# EAGLE design AIN_J5_J7_VoltSlide (EAGLE 7.5.0)
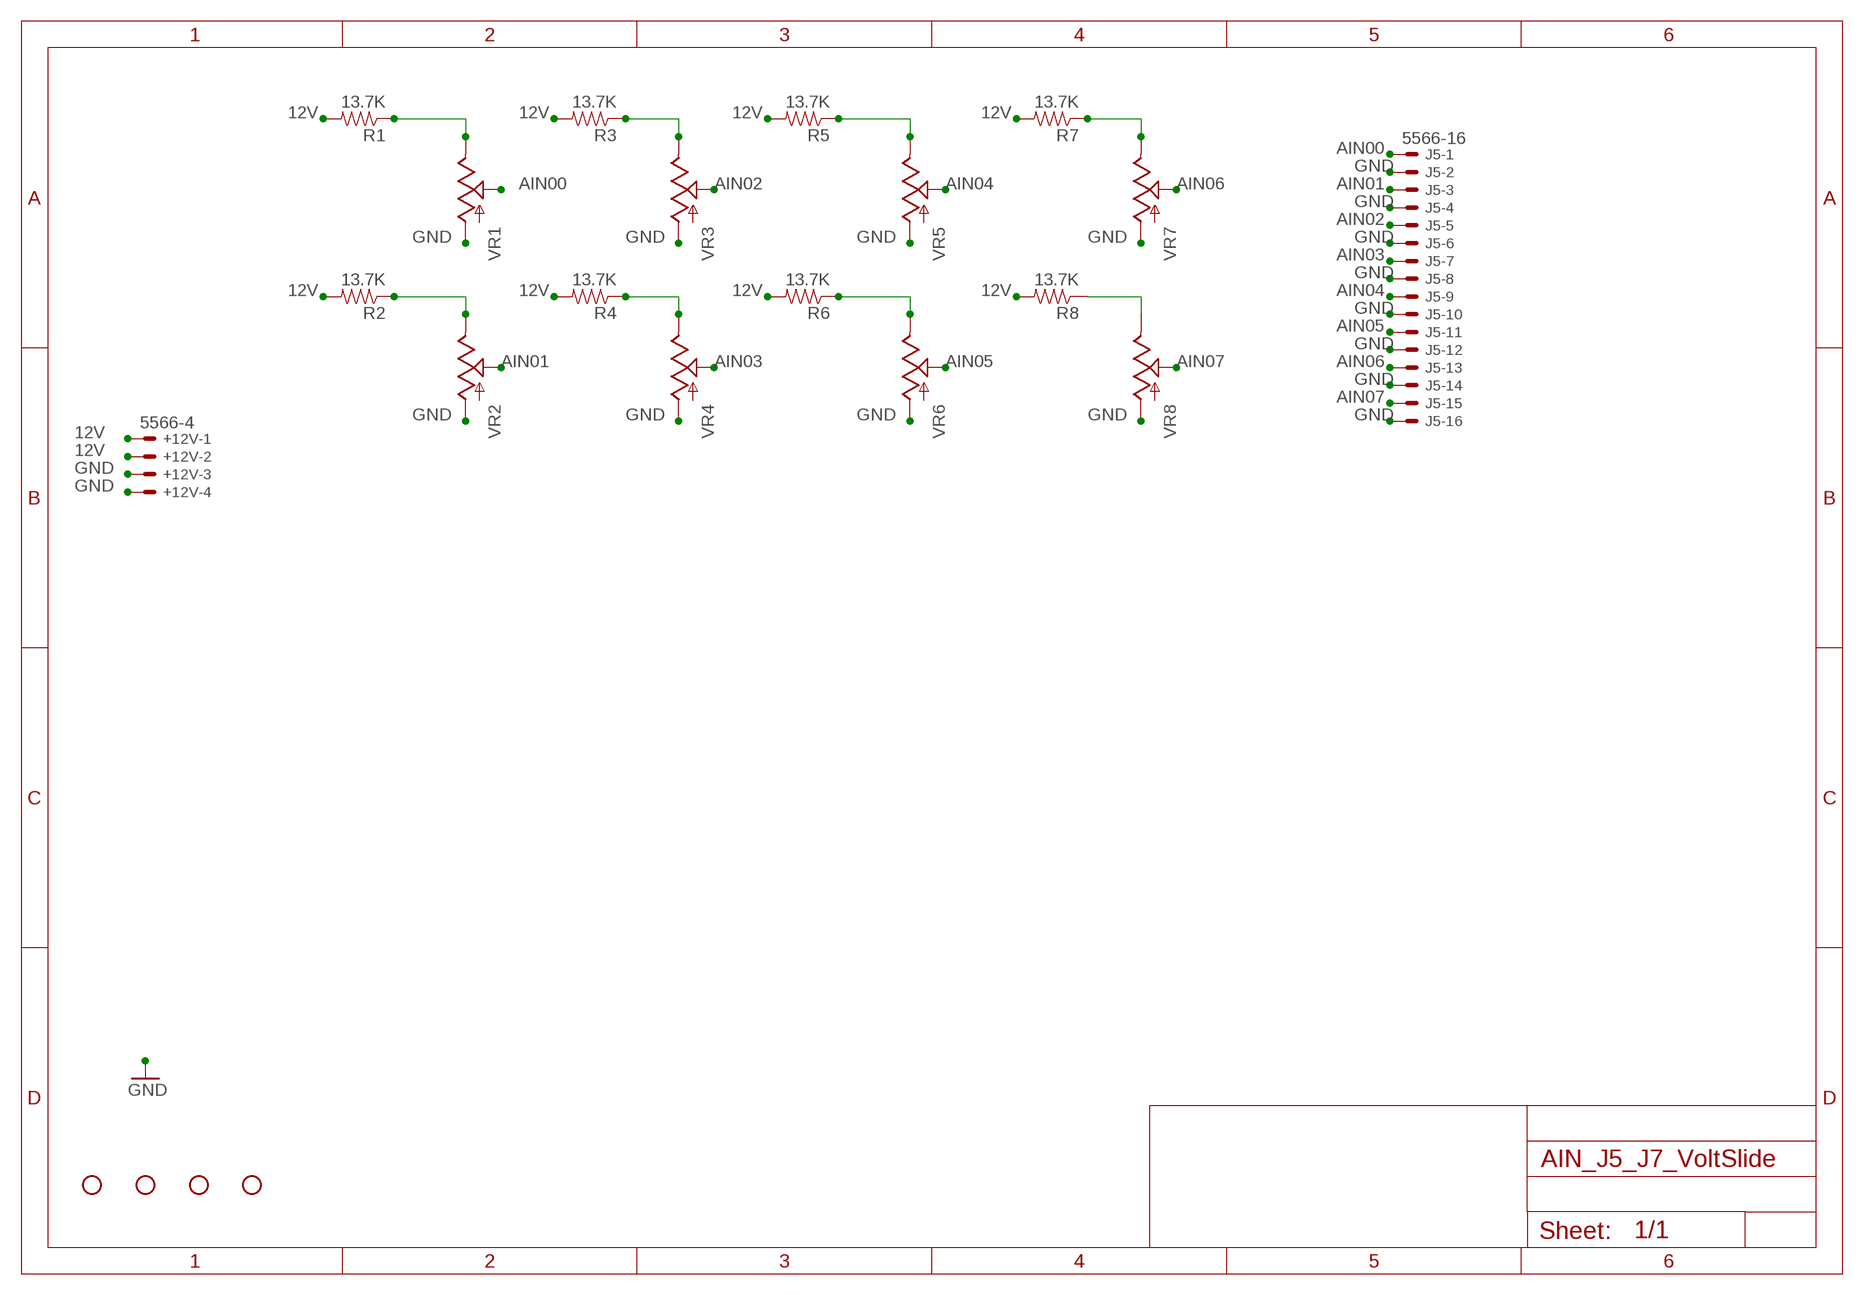
[diagram p0: schematic, sheet 1]

## Parts
+12V  5566-4  [5566-4]
H1  STAND-OFF  [STAND-OFF]
H2  STAND-OFF  [STAND-OFF]
H3  STAND-OFF  [STAND-OFF]
H4  STAND-OFF  [STAND-OFF]
J5  5566-16  [5566-16]
R1  13.7K  13.7KOHM1/10W1%(0603)  [0603-RES]
R2  13.7K  13.7KOHM1/10W1%(0603)  [0603-RES]
R3  13.7K  13.7KOHM1/10W1%(0603)  [0603-RES]
R4  13.7K  13.7KOHM1/10W1%(0603)  [0603-RES]
R5  13.7K  13.7KOHM1/10W1%(0603)  [0603-RES]
R6  13.7K  13.7KOHM1/10W1%(0603)  [0603-RES]
R7  13.7K  13.7KOHM1/10W1%(0603)  [0603-RES]
R8  13.7K  13.7KOHM1/10W1%(0603)  [0603-RES]
VR1  SLIDER30MM  [SLIDER-MEDIUM]
VR2  SLIDER30MM  [SLIDER-MEDIUM]
VR3  SLIDER30MM  [SLIDER-MEDIUM]
VR4  SLIDER30MM  [SLIDER-MEDIUM]
VR5  SLIDER30MM  [SLIDER-MEDIUM]
VR6  SLIDER30MM  [SLIDER-MEDIUM]
VR7  SLIDER30MM  [SLIDER-MEDIUM]
VR8  SLIDER30MM  [SLIDER-MEDIUM]

## Nets
12V: +12V.1 +12V.2 R1.2 R2.2 R3.2 R4.2 R5.2 R6.2 R7.2 R8.2
AIN00: J5.1 VR1.WIPER(S)
AIN01: J5.3 VR2.WIPER(S)
AIN02: J5.5 VR3.WIPER(S)
AIN03: J5.7 VR4.WIPER(S)
AIN04: J5.9 VR5.WIPER(S)
AIN05: J5.11 VR6.WIPER(S)
AIN06: J5.13 VR7.WIPER(S)
AIN07: J5.15 VR8.WIPER(S)
GND: +12V.3 +12V.4 J5.2 J5.4 J5.6 J5.8 J5.10 J5.12 J5.14 J5.16 VR1.BOTTOM(A) VR2.BOTTOM(A) VR3.BOTTOM(A) VR4.BOTTOM(A) VR5.BOTTOM(A) VR6.BOTTOM(A) VR7.BOTTOM(A) VR8.BOTTOM(A)
N$1: R8.1 VR8.TOP(E)
N$37: R1.1 VR1.TOP(E)
N$38: R3.1 VR3.TOP(E)
N$39: R5.1 VR5.TOP(E)
N$44: R6.1 VR6.TOP(E)
N$45: R2.1 VR2.TOP(E)
N$49: R4.1 VR4.TOP(E)
N$89: R7.1 VR7.TOP(E)

## Library data of the parts
+12V = con-molex:5566-4: Mini FIT connector 4 pol Source: http://www.molex.com
H1-H4 = SparkFun-Electromechanical:STAND-OFF: #4 Stand Off This is the mechanical footprint for a #4 phillips button head screw. Use the keepout ring to avoid running the screw head into surrounding components. SKU : PRT-00447
J5 = con-molex:5566-16: Mini FIT connector 16 pol Source: http://www.molex.com
R1-R8 = SparkFun-Resistors:13.7KOHM1/10W1%(0603): RES-08603; PROD_ID: RES-08603
VR1-VR8 = SparkFun-Electromechanical:SLIDER: Slide-type potentiometers. Small and meduim footprints untested.; PROD_ID: COM-11621

## Board
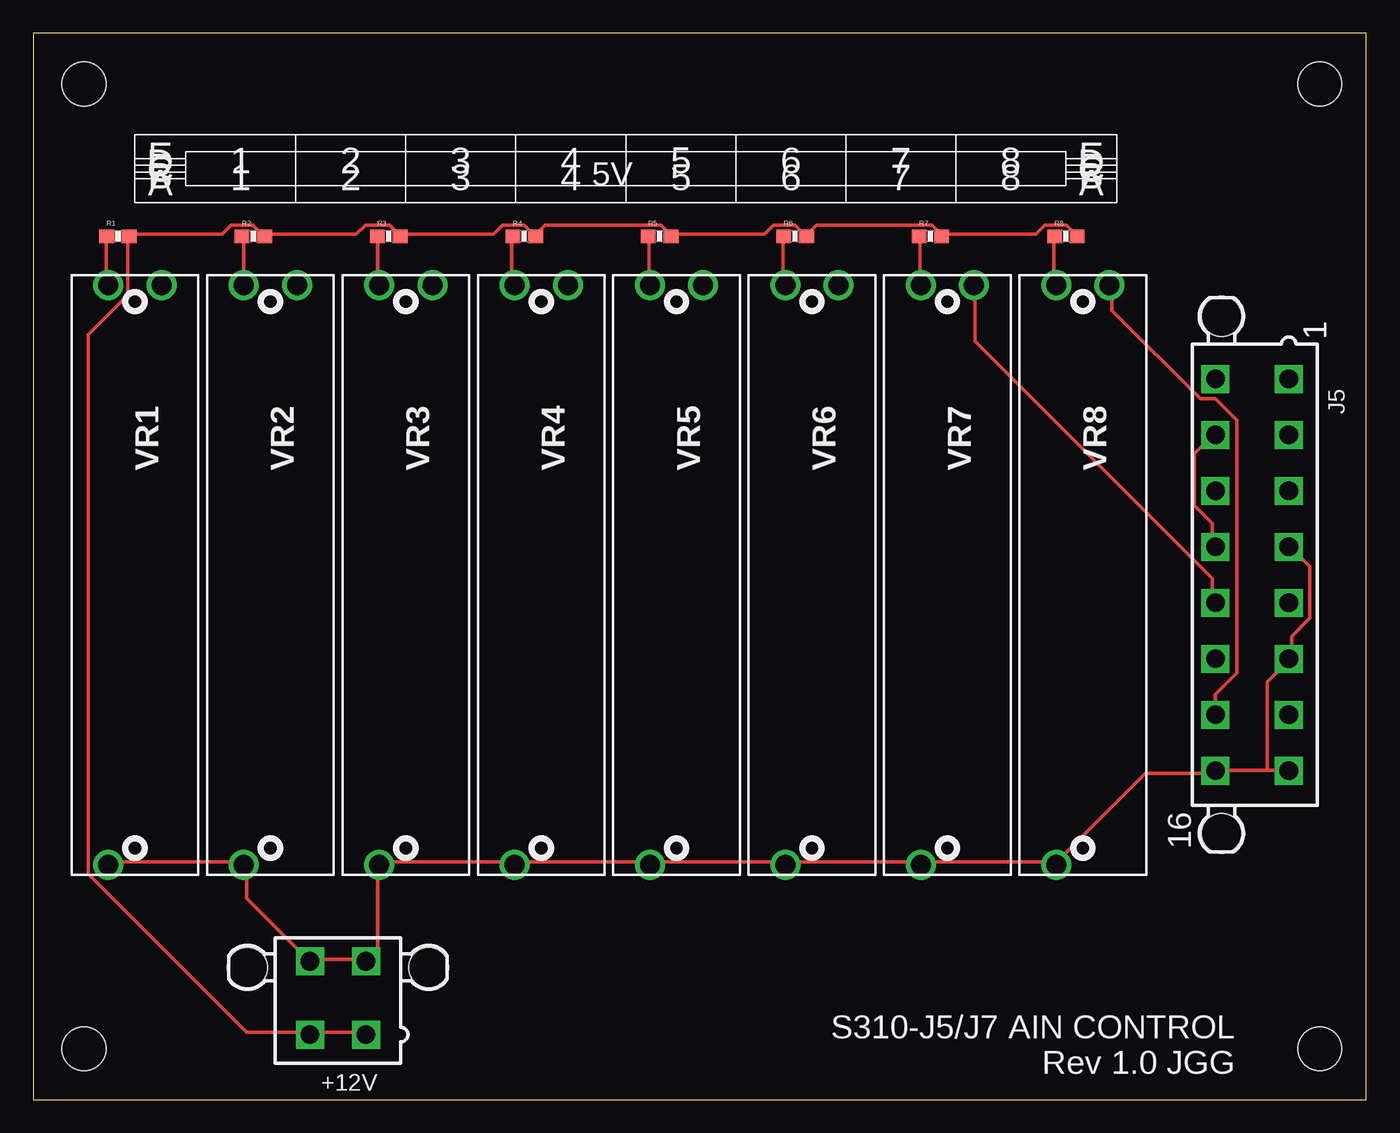
[diagram p1: board, top side]
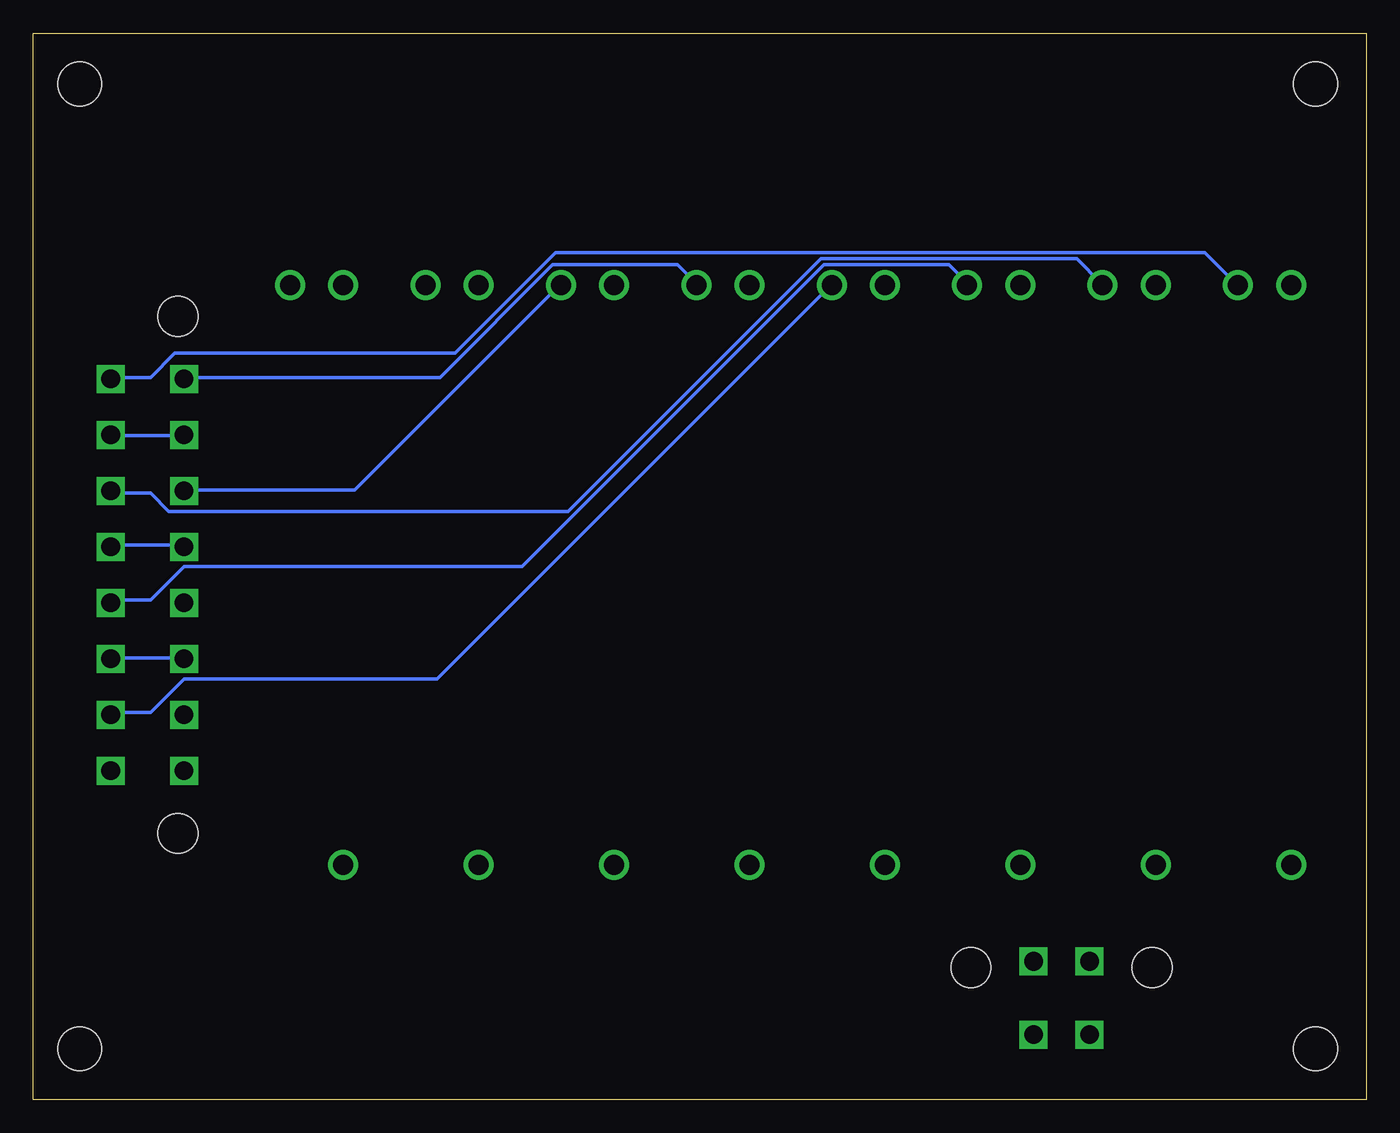
[diagram p2: board, bottom side, seen from below]

Size 100 x 80 mm. Coordinates in mm from the lower left corner, seen from the top.
Outline: 0,0 100,0 100,80 0,80 0,0
Copper layers (1*16): Top 0.035mm / dielectric 1.5mm / Bottom 0.035mm
Design rules "default": minimum track width 10mil, minimum drill 24mil, track to track 8mil, track to pad 8mil, pad to pad 8mil, via to via 8mil, smd to smd 8mil, copper to edge 40mil, drill to drill 8mil, minimum pad ring 10mil, minimum via ring 8mil, stop-mask expansion 4mil, vias tented up to drill 0mil, thermal gap 10mil

### Footprints (pad centres in the part's own frame; a part is rotated, then mirrored left to right if it is on the bottom)
5566-4 = drill 1.4 square: 1 2.1,-2.75; 2 -2.1,-2.75; 3 2.1,2.75; 4 -2.1,2.75 | hole 3: 6.8,2.29; -6.8,2.29
STAND-OFF = hole 3.302: 0,0
5566-16 = drill 1.4 square: 1 14.7,-2.75; 2 10.5,-2.75; 3 6.3,-2.75; 4 2.1,-2.75; 5 -2.1,-2.75; 6 -6.3,-2.75; 7 -10.5,-2.75; 8 -14.7,-2.75; 9 14.7,2.75; 10 10.5,2.75; 11 6.3,2.75; 12 2.1,2.75; 13 -2.1,2.75; 14 -6.3,2.75; 15 -10.5,2.75; 16 -14.7,2.75 | hole 3: 19.4,2.29; -19.4,2.29
0603-RES = smd 1.1 x 1: 1 -0.85,0; 2 0.85,0
SLIDER-MEDIUM = drill 1.5: BOTTOM 21.75,-2; TOP -21.75,-2; WIPER -21.75,2

### Placement (x,y rotation side)
+12V  22.86,7.62 0 top
H1  96.52,3.81 0 top
H2  3.81,3.81 0 top
H3  96.52,76.2 0 top
H4  3.81,76.2 0 top
J5  91.44,39.37 90 top
R1  6.35,64.77 0 top
R2  16.51,64.77 0 top
R3  26.67,64.77 0 top
R4  36.83,64.77 0 top
R5  46.99,64.77 0 top
R6  57.15,64.77 0 top
R7  67.31,64.77 0 top
R8  77.47,64.77 0 top
VR1  7.62,39.37 270 top
VR2  17.78,39.37 270 top
VR3  27.94,39.37 270 top
VR4  38.1,39.37 270 top
VR5  48.26,39.37 270 top
VR6  58.42,39.37 270 top
VR7  68.58,39.37 270 top
VR8  78.74,39.37 270 top

### Tracks (layer width: path | path; a pad name or v marks a point on that pad's centre or on a via)
12V
  Top 0.254: +12V.1 24.92,5.03 20.8,5.03 +12V.2 20.57,5.03 16,5.03 4.12,16.92 4.12,57.38 7.09,60.35 7.09,64.69 R1.2 7.32,64.92 14.17,64.92 14.86,65.61 16.46,65.61 17.14,64.92 R2.2 17.37,64.92 24.23,64.92 24.92,65.61 26.75,65.61 27.43,64.92 R3.2 27.66,64.92 34.52,64.92 35.2,65.61 36.8,65.61 37.49,64.92 R4.2 37.72,64.92 38.41,65.61 47.09,65.61 47.78,64.92 R5.2 48.01,64.92 54.86,64.92 55.55,65.61 57.15,65.61 57.84,64.92 R6.2 58.06,64.92 58.75,65.61 67.44,65.61 68.12,64.92 R7.2 68.35,64.92 75.21,64.92 75.89,65.61 77.5,65.61 78.18,64.92 R8.2
AIN00
  Bottom 0.254: J5.1 94.18,54.18 91.21,54.18 89.38,56.01 68.35,56.01 60.81,63.55 12.12,63.55 9.83,61.27 VR1.WIPER
AIN01
  Bottom 0.254: J5.3 94.18,45.49 91.21,45.49 89.84,44.12 59.89,44.12 40.92,63.09 21.72,63.09 19.89,61.27 VR2.WIPER
AIN02
  Bottom 0.254: J5.5 94.18,37.49 91.21,37.49 88.7,40.01 63.32,40.01 40.69,62.64 31.32,62.64 29.95,61.27 VR3.WIPER
AIN03
  Bottom 0.254: J5.7 94.18,29.03 91.21,29.03 88.7,31.55 69.72,31.55 40.23,61.04 VR4.WIPER
AIN04
  Bottom 0.254: J5.9 88.47,54.18 69.49,54.18 61.04,62.64 51.66,62.64 50.29,61.27 VR5.WIPER
AIN05
  Bottom 0.254: J5.11 88.47,45.72 75.89,45.72 60.58,61.04 VR6.WIPER
AIN06
  Top 0.254: J5.13 88.47,37.49 88.47,39.09 70.64,56.92 70.64,61.04 VR7.WIPER
AIN07
  Top 0.254: J5.15 88.7,29.03 88.7,30.4 90.3,32 90.3,50.98 88.7,52.58 87.55,52.58 80.92,59.21 80.92,61.04 VR8.WIPER
GND
  Top 0.254: 92.58,24.69 94.18,24.69 J5.8 | 92.58,24.69 88.7,24.69 J5.16 88.47,24.46 83.44,24.46 76.81,17.83 VR8.BOTTOM 76.58,17.83 66.75,17.83 VR7.BOTTOM 66.52,17.83 56.46,17.83 VR6.BOTTOM 56.24,17.83 46.41,17.83 VR5.BOTTOM 46.18,17.83 36.12,17.83 VR4.BOTTOM 35.89,17.83 26.06,17.83 VR3.BOTTOM 25.83,17.6 25.83,11.2 25.15,10.52 +12V.3 24.92,10.52 20.8,10.52 +12V.4 20.57,10.52 16,15.09 16,17.6 VR2.BOTTOM 15.77,17.83 5.71,17.83 VR1.BOTTOM | 92.58,24.69 92.58,31.32 94.18,32.92 J5.6 94.41,33.15 94.41,34.75 95.78,36.12 95.78,40.01 94.41,41.38 J5.4 | J5.12 88.47,41.6 88.47,43.2 87.1,44.58 87.1,48.46 88.47,49.84 J5.10
  Bottom 0.254: J5.14 88.7,33.15 94.18,33.15 J5.6 | J5.12 88.7,41.6 94.18,41.6 J5.4 | J5.10 88.7,49.84 94.18,49.84 J5.2
N$1
  Top 0.254: R8.1 76.58,64.69 76.58,61.27 VR8.TOP
N$37
  Top 0.254: R1.1 5.49,64.69 5.49,61.27 VR1.TOP
N$38
  Top 0.254: R3.1 25.83,64.69 25.83,61.27 VR3.TOP
N$39
  Top 0.254: R5.1 46.18,64.69 46.18,61.27 VR5.TOP
N$44
  Top 0.254: R6.1 56.24,64.69 56.24,61.27 VR6.TOP
N$45
  Top 0.254: R2.1 15.77,64.69 15.77,61.27 VR2.TOP
N$49
  Top 0.254: R4.1 35.89,64.69 35.89,61.27 VR4.TOP
N$89
  Top 0.254: R7.1 66.52,64.69 66.52,61.27 VR7.TOP

### Text on the board
tNames: 5V | 1 | 16 | S310-J5/J7 AIN CONTROL / Rev 1.0 JGG